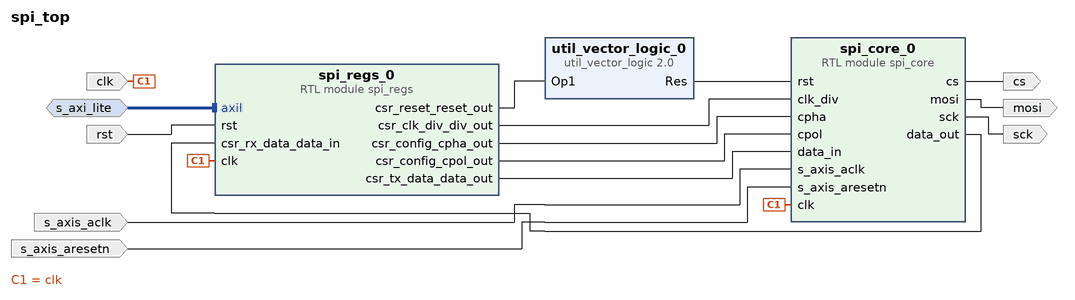
[diagram p0: block diagram of the top level]
# Vivado block design spi_top, xc7z010clg400-1, Vivado 2022.2
create_bd_design spi_top

create_bd_intf_port -mode Slave -vlnv xilinx.com:interface:aximm_rtl:1.0 s_axi_lite
set_property -dict [list \
  CONFIG.ADDR_WIDTH 10 \
  CONFIG.ARUSER_WIDTH 0 \
  CONFIG.AWUSER_WIDTH 0 \
  CONFIG.BUSER_WIDTH 0 \
  CONFIG.DATA_WIDTH 32 \
  CONFIG.HAS_BRESP 1 \
  CONFIG.HAS_BURST 0 \
  CONFIG.HAS_CACHE 0 \
  CONFIG.HAS_LOCK 0 \
  CONFIG.HAS_PROT 1 \
  CONFIG.HAS_QOS 0 \
  CONFIG.HAS_REGION 0 \
  CONFIG.HAS_RRESP 1 \
  CONFIG.HAS_WSTRB 1 \
  CONFIG.ID_WIDTH 0 \
  CONFIG.MAX_BURST_LENGTH 1 \
  CONFIG.NUM_READ_OUTSTANDING 1 \
  CONFIG.NUM_READ_THREADS 1 \
  CONFIG.NUM_WRITE_OUTSTANDING 1 \
  CONFIG.NUM_WRITE_THREADS 1 \
  CONFIG.PROTOCOL AXI4LITE \
  CONFIG.READ_WRITE_MODE READ_WRITE \
  CONFIG.RUSER_BITS_PER_BYTE 0 \
  CONFIG.RUSER_WIDTH 0 \
  CONFIG.SUPPORTS_NARROW_BURST 0 \
  CONFIG.WUSER_BITS_PER_BYTE 0 \
  CONFIG.WUSER_WIDTH 0 \
] [get_bd_intf_ports s_axi_lite]
create_bd_port -dir I -type clk s_axis_aclk
create_bd_port -dir I -type rst s_axis_aresetn
create_bd_port -dir O cs
create_bd_port -dir O sck
create_bd_port -dir O mosi
create_bd_port -dir I -type rst rst
create_bd_port -dir I -type clk clk

create_bd_cell -type module -reference spi_regs spi_regs_0
create_bd_cell -type ip -vlnv xilinx.com:ip:util_vector_logic:2.0 util_vector_logic_0
set_property -dict {CONFIG.C_OPERATION not CONFIG.C_SIZE 1} [get_bd_cells util_vector_logic_0]
create_bd_cell -type module -reference spi_core spi_core_0

# ---- connections ----

connect_bd_intf_net -intf_net axil_0_1 [get_bd_intf_ports s_axi_lite] [get_bd_intf_pins spi_regs_0/axil]
connect_bd_net -net clk_0_1 [get_bd_ports clk] [get_bd_pins spi_regs_0/clk] [get_bd_pins spi_core_0/clk]
connect_bd_net -net rst_0_1 [get_bd_ports rst] [get_bd_pins spi_regs_0/rst]
connect_bd_net -net s_axis_aclk_0_1 [get_bd_ports s_axis_aclk] [get_bd_pins spi_core_0/s_axis_aclk]
connect_bd_net -net s_axis_aresetn_0_1 [get_bd_ports s_axis_aresetn] [get_bd_pins spi_core_0/s_axis_aresetn]
connect_bd_net [get_bd_pins spi_core_0/cs] [get_bd_ports cs]
connect_bd_net [get_bd_pins spi_core_0/data_out] [get_bd_pins spi_regs_0/csr_rx_data_data_in]
connect_bd_net [get_bd_pins spi_core_0/mosi] [get_bd_ports mosi]
connect_bd_net [get_bd_pins spi_core_0/sck] [get_bd_ports sck]
connect_bd_net [get_bd_pins spi_regs_0/csr_clk_div_div_out] [get_bd_pins spi_core_0/clk_div]
connect_bd_net [get_bd_pins spi_regs_0/csr_config_cpha_out] [get_bd_pins spi_core_0/cpha]
connect_bd_net [get_bd_pins spi_regs_0/csr_config_cpol_out] [get_bd_pins spi_core_0/cpol]
connect_bd_net [get_bd_pins spi_regs_0/csr_reset_reset_out] [get_bd_pins util_vector_logic_0/Op1]
connect_bd_net [get_bd_pins spi_regs_0/csr_tx_data_data_out] [get_bd_pins spi_core_0/data_in]
connect_bd_net [get_bd_pins util_vector_logic_0/Res] [get_bd_pins spi_core_0/rst]

validate_bd_design
save_bd_design
